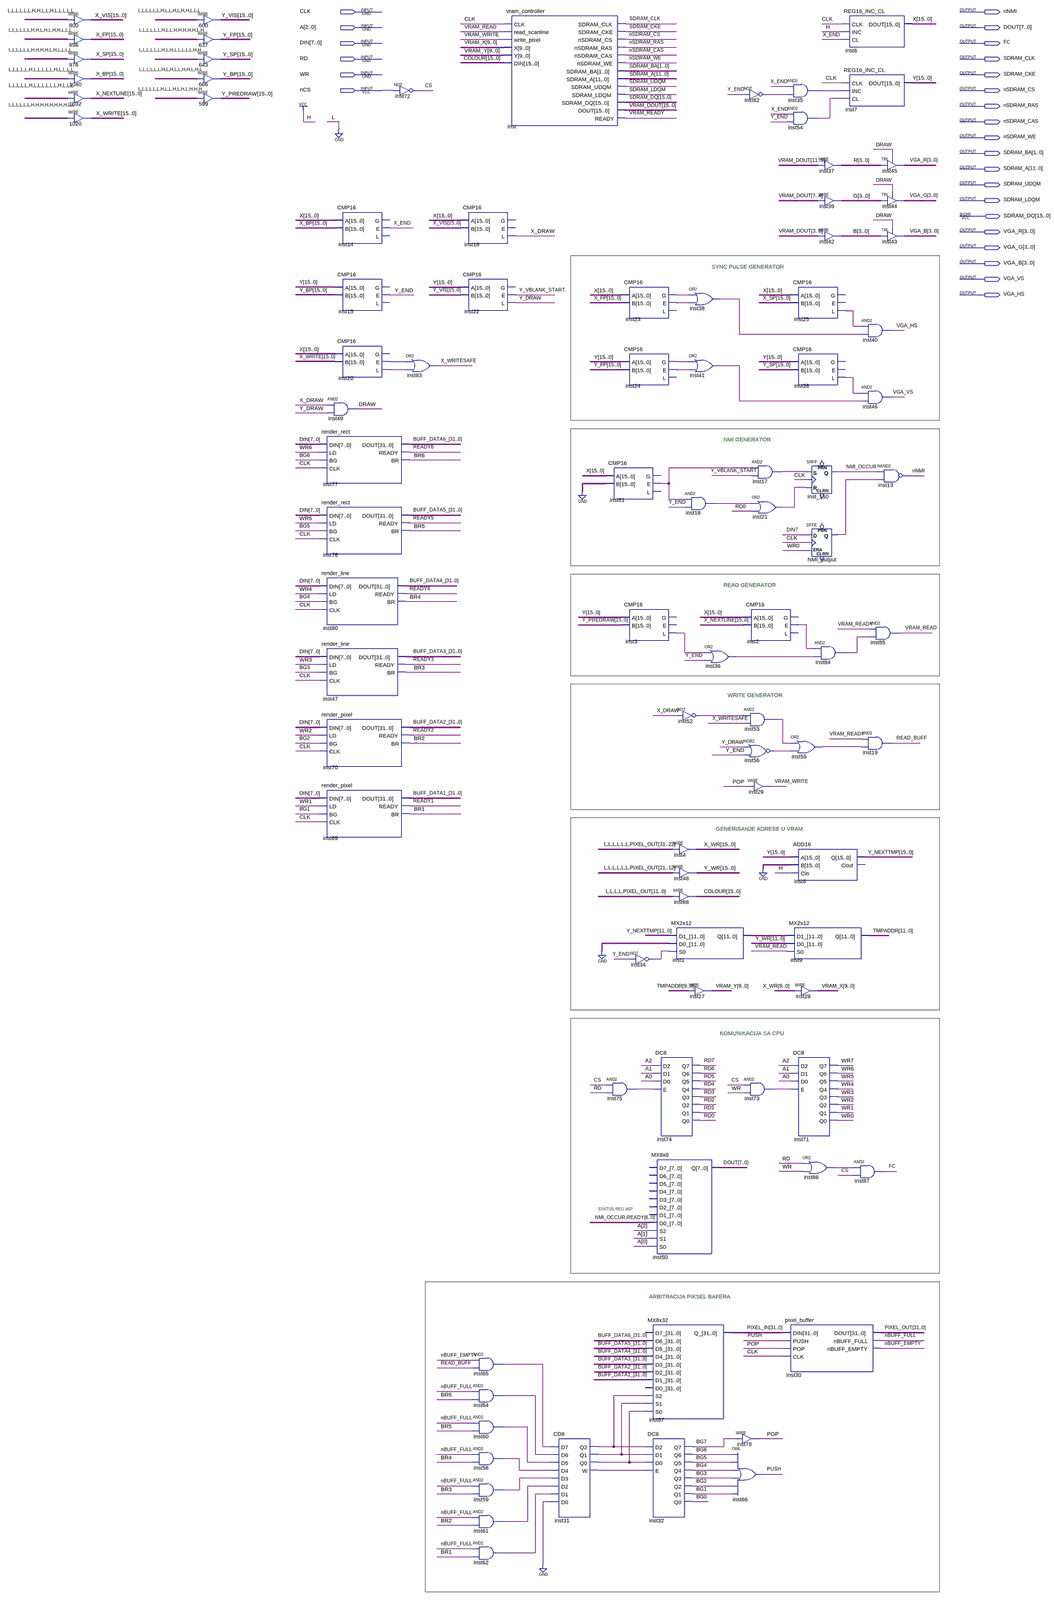
[diagram p0: schematic sheet, whole]
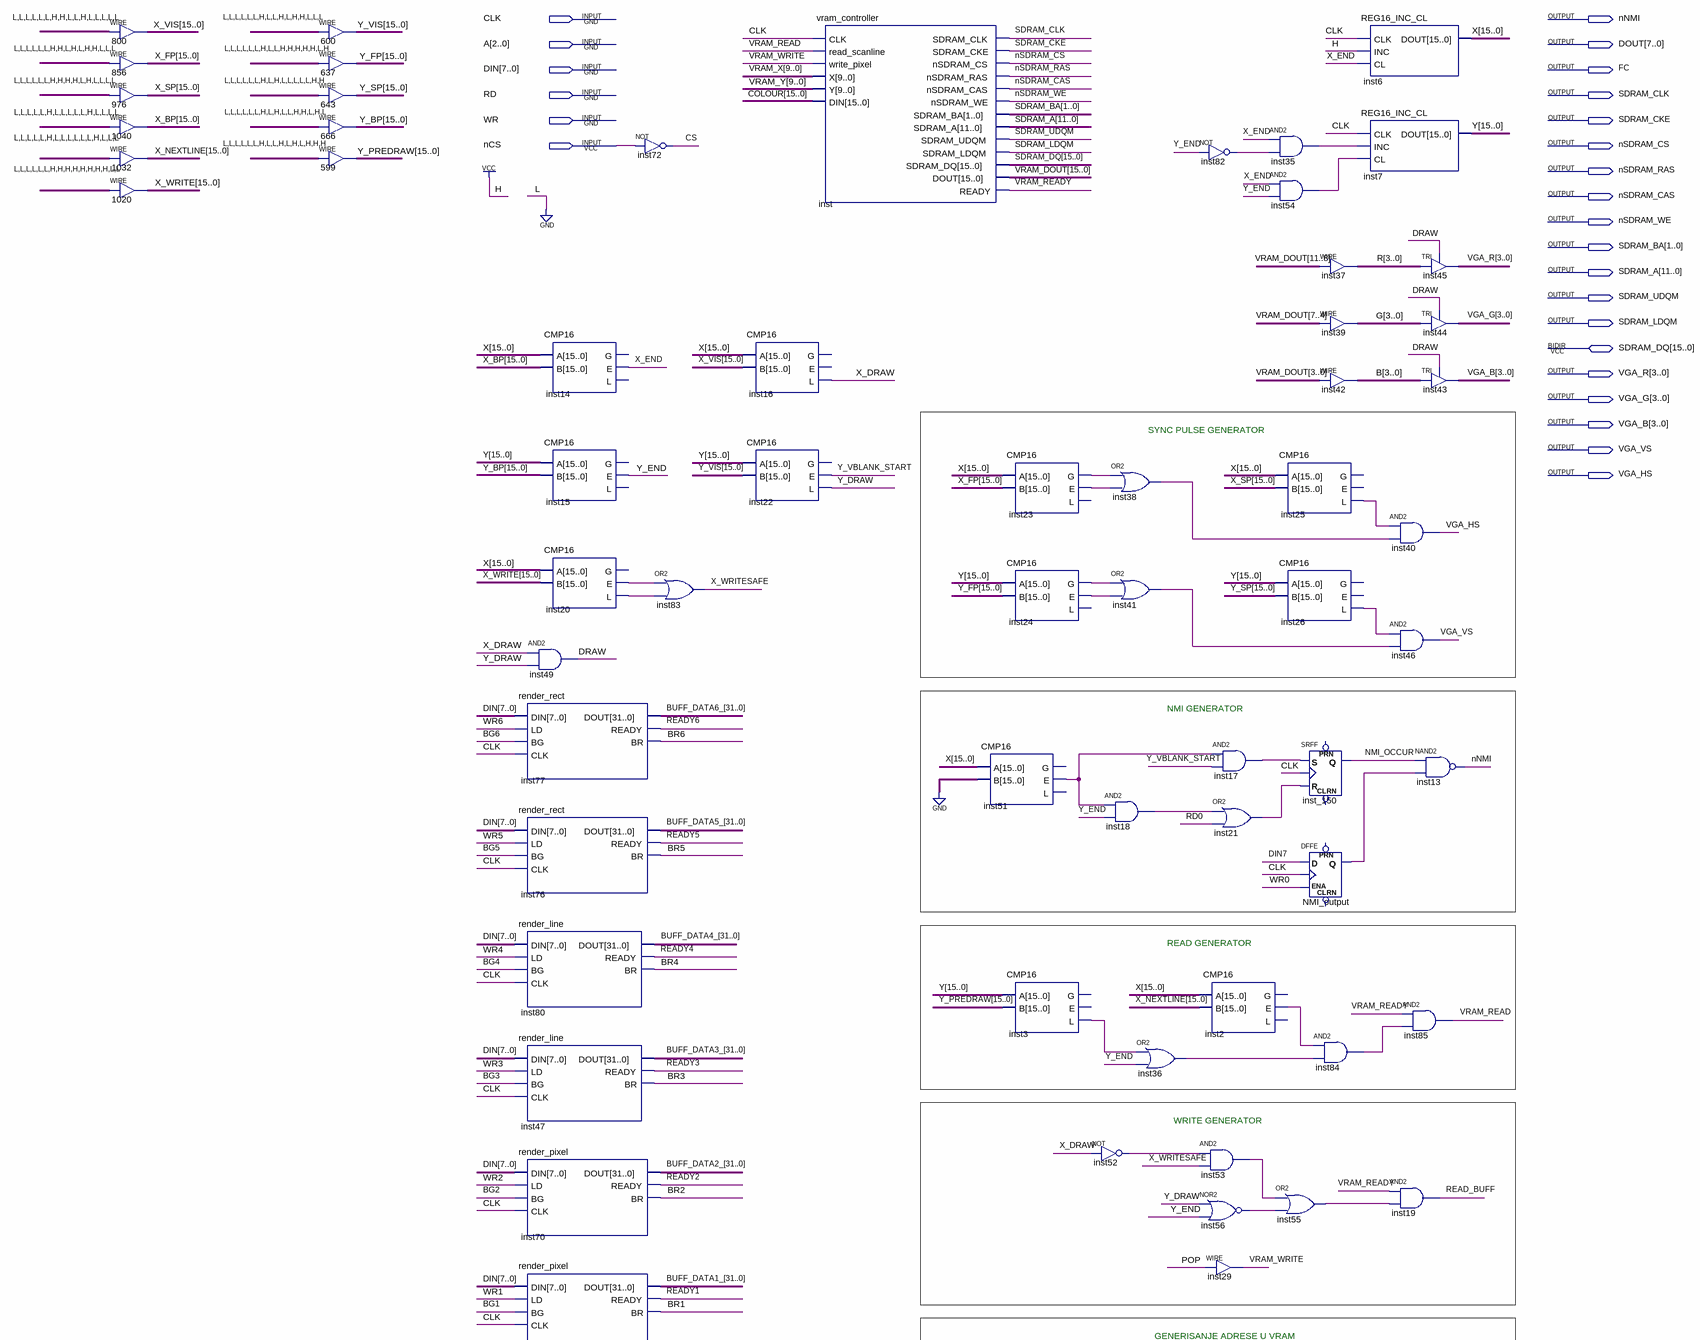
[diagram p1: schematic sheet, upper part]
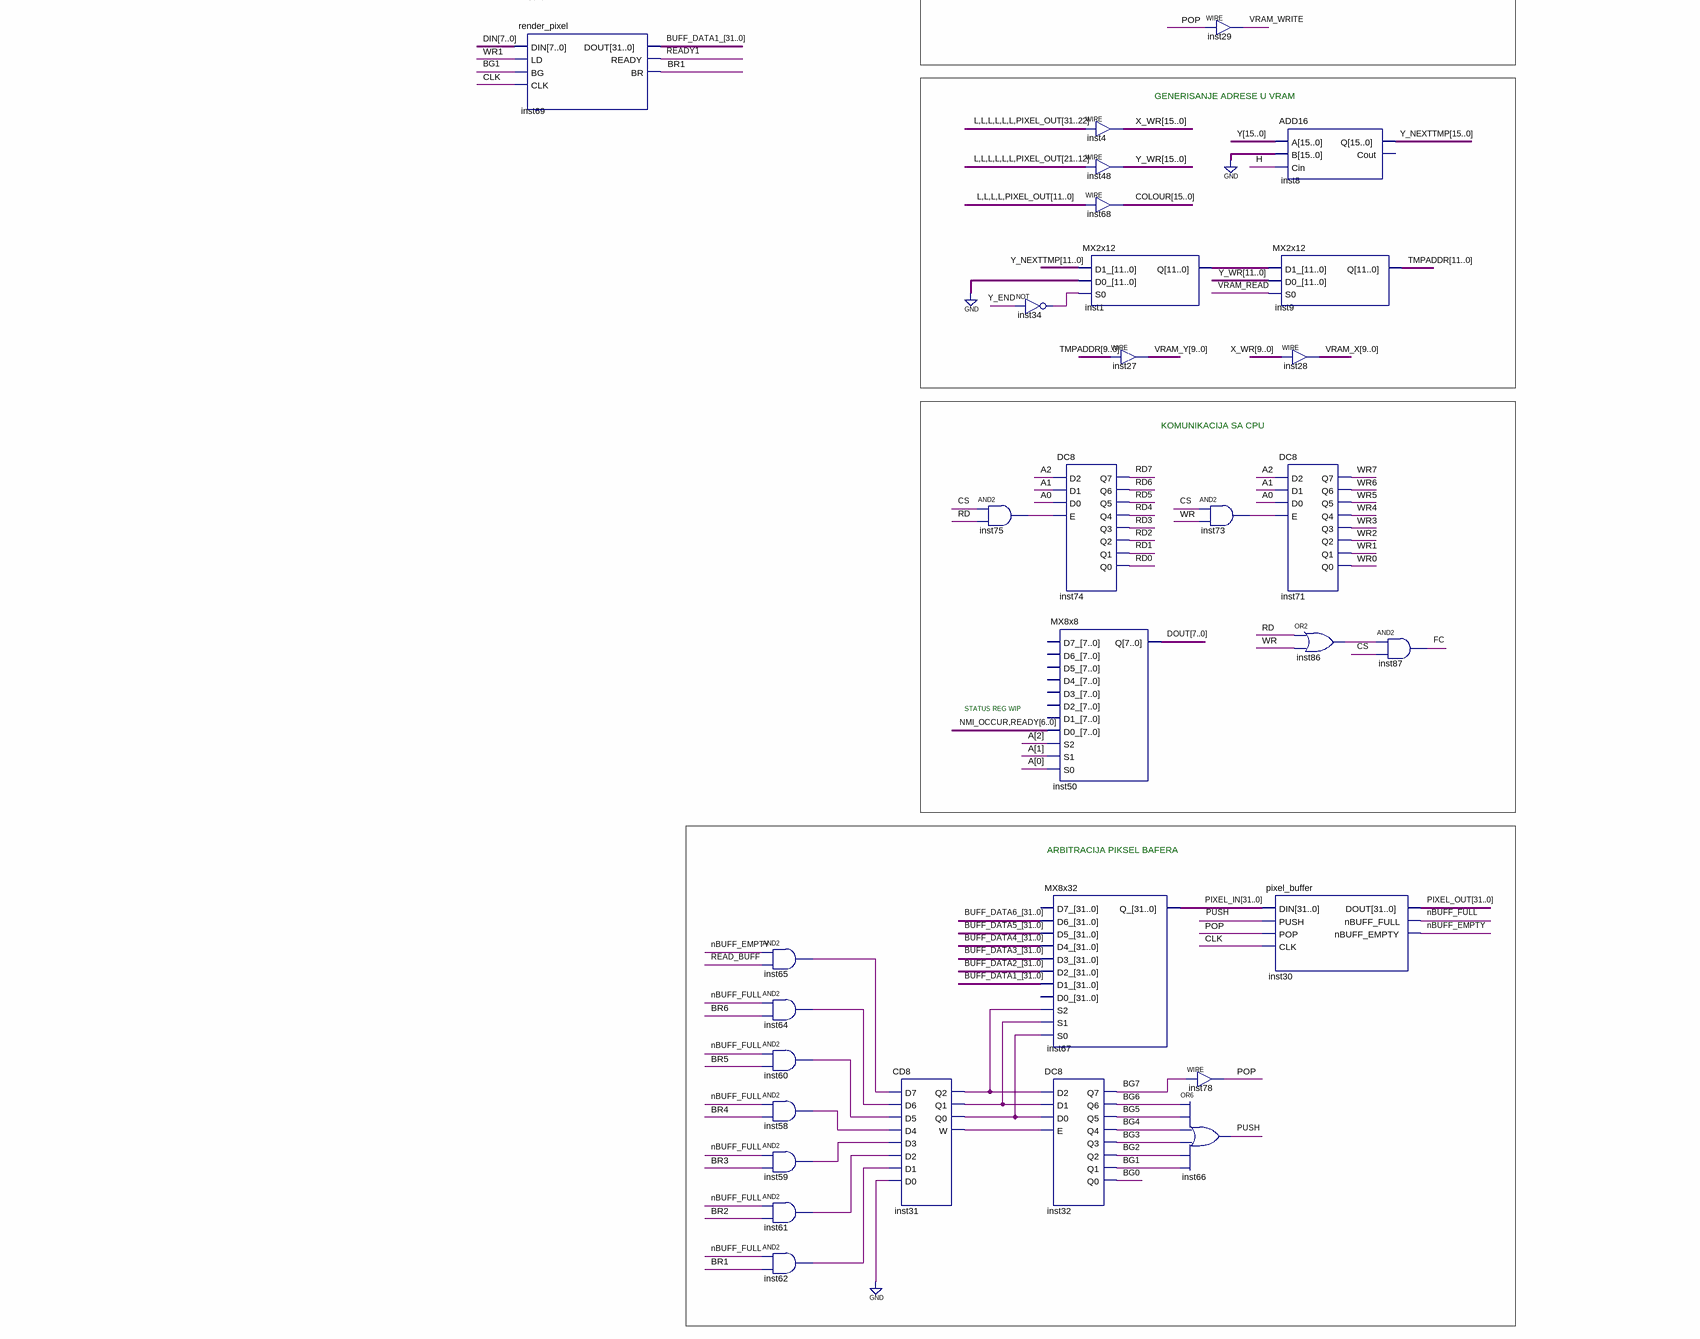
[diagram p2: schematic sheet, lower part]
// Quartus schematic gpu.bdf as structural Verilog: 92 symbols, 25 pins
module gpu (
  input  CLK,
  input  [2:0] A,
  input  [7:0] DIN,
  input  RD,
  input  WR,
  input  nCS,
  inout  [15:0] SDRAM_DQ,
  output nNMI,
  output [7:0] DOUT,
  output FC,
  output SDRAM_CLK,
  output SDRAM_CKE,
  output nSDRAM_CS,
  output nSDRAM_RAS,
  output nSDRAM_CAS,
  output nSDRAM_WE,
  output [1:0] SDRAM_BA,
  output [11:0] SDRAM_A,
  output SDRAM_UDQM,
  output SDRAM_LDQM,
  output [3:0] VGA_R,
  output [3:0] VGA_G,
  output [3:0] VGA_B,
  output VGA_VS,
  output VGA_HS
);

  wire BG0, BG1, BG2, BG3, BG4, BG5, BG6, BG7, BR1, BR2, BR3, BR4, BR5, BR6, CS, DRAW, inst2_e, inst3_l,
       inst17_out, inst18_out, inst20_e, inst20_l, inst21_out, inst23_e, inst23_g, inst24_e, inst24_g,
       inst25_l, inst26_l, inst31_q0, inst31_q1, inst31_q2, inst31_w, inst34_out, inst35_out, inst36_out,
       inst38_out, inst41_out, inst51_e, inst52_out, inst53_out, inst54_out, inst55_out, inst56_out,
       inst58_out, inst59_out, inst60_out, inst61_out, inst62_out, inst64_out, inst65_out, inst73_out,
       inst75_out, inst82_out, inst84_out, inst86_out, nBUFF_EMPTY, nBUFF_FULL, NMI_OCCUR, NMI_output_q, POP,
       PUSH, RD0, RD1, RD2, RD3, RD4, RD5, RD6, RD7, READ_BUFF, VRAM_READ, VRAM_READY, VRAM_WRITE, WR0, WR1,
       WR2, WR3, WR4, WR5, WR6, WR7, X_DRAW, X_END, X_WRITESAFE, Y_DRAW, Y_END, Y_VBLANK_START;
  wire [3:0] B, G, R;
  wire [6:0] READY;
  wire [9:0] VRAM_X, VRAM_Y;
  wire [11:0] inst1_q, TMPADDR;
  wire [15:0] COLOUR, VRAM_DOUT, X, X_BP, X_FP, X_NEXTLINE, X_SP, X_VIS, X_WR, X_WRITE, Y, Y_BP, Y_FP,
       Y_NEXTTMP, Y_PREDRAW, Y_SP, Y_VIS, Y_WR;
  wire [31:0] BUFF_DATA1_, BUFF_DATA2_, BUFF_DATA3_, BUFF_DATA4_, BUFF_DATA5_, BUFF_DATA6_, PIXEL_IN,
       PIXEL_OUT;

  assign X_VIS = 16'b0000001100100000;  // WIRE 800
  assign X_FP = 16'b0000001101011000;  // WIRE 856
  assign X_SP = 16'b0000001111010000;  // WIRE 976
  assign X_BP = 16'b0000010000010000;  // WIRE 1040
  assign X_NEXTLINE = 16'b0000010000001000;  // WIRE 1032
  assign X_WRITE = 16'b0000001111111100;  // WIRE 1020
  assign Y_VIS = 16'b0000001001011000;  // WIRE 600
  assign Y_FP = 16'b0000001001111101;  // WIRE 637
  assign Y_SP = 16'b0000001010000011;  // WIRE 643
  assign Y_BP = 16'b0000001010011010;  // WIRE 666
  assign Y_PREDRAW = 16'b0000001001010111;  // WIRE 599
  CMP16 inst14 (.A(X), .B(X_BP), .E(X_END));  // open: G, L
  CMP16 inst15 (.A(Y), .B(Y_BP), .E(Y_END));  // open: G, L
  CMP16 inst20 (.A(X), .B(X_WRITE), .E(inst20_e), .L(inst20_l));  // open: G
  and inst49 (DRAW, X_DRAW, Y_DRAW);
  render_rect inst77 (.DIN(DIN), .LD(WR6), .BG(BG6), .CLK(CLK), .DOUT(BUFF_DATA6_), .READY(READY[6]), .BR(BR6));
  render_rect inst76 (.DIN(DIN), .LD(WR5), .BG(BG5), .CLK(CLK), .DOUT(BUFF_DATA5_), .READY(READY[5]), .BR(BR5));
  render_line inst80 (.DIN(DIN), .LD(WR4), .BG(BG4), .CLK(CLK), .DOUT(BUFF_DATA4_), .READY(READY[4]), .BR(BR4));
  render_line inst47 (.DIN(DIN), .LD(WR3), .BG(BG3), .CLK(CLK), .DOUT(BUFF_DATA3_), .READY(READY[3]), .BR(BR3));
  render_pixel inst70 (.DIN(DIN), .LD(WR2), .BG(BG2), .CLK(CLK), .DOUT(BUFF_DATA2_), .READY(READY[2]), .BR(BR2));
  render_pixel inst69 (.DIN(DIN), .LD(WR1), .BG(BG1), .CLK(CLK), .DOUT(BUFF_DATA1_), .READY(READY[1]), .BR(BR1));
  not inst72 (CS, nCS);
  or inst83 (X_WRITESAFE, inst20_e, inst20_l);
  CMP16 inst16 (.A(X), .B(X_VIS), .L(X_DRAW));  // open: G, E
  CMP16 inst22 (.A(Y), .B(Y_VIS), .E(Y_VBLANK_START), .L(Y_DRAW));  // open: G
  and inst65 (inst65_out, nBUFF_EMPTY, READ_BUFF);
  and inst64 (inst64_out, nBUFF_FULL, BR6);
  and inst60 (inst60_out, nBUFF_FULL, BR5);
  and inst58 (inst58_out, nBUFF_FULL, BR4);
  and inst59 (inst59_out, nBUFF_FULL, BR3);
  and inst61 (inst61_out, nBUFF_FULL, BR2);
  and inst62 (inst62_out, nBUFF_FULL, BR1);
  vram_controller inst (
    .CLK(CLK), .read_scanline(VRAM_READ), .write_pixel(VRAM_WRITE), .X(VRAM_X), .Y(VRAM_Y), .DIN(COLOUR),
    .SDRAM_CLK(SDRAM_CLK), .SDRAM_CKE(SDRAM_CKE), .nSDRAM_CS(nSDRAM_CS), .nSDRAM_RAS(nSDRAM_RAS),
    .nSDRAM_CAS(nSDRAM_CAS), .nSDRAM_WE(nSDRAM_WE), .SDRAM_BA(SDRAM_BA), .SDRAM_A(SDRAM_A),
    .SDRAM_UDQM(SDRAM_UDQM), .SDRAM_LDQM(SDRAM_LDQM), .DOUT(VRAM_DOUT), .READY(VRAM_READY),
    .SDRAM_DQ(SDRAM_DQ));
  CD8 inst31 (
    .D7(inst65_out), .D6(inst64_out), .D5(inst60_out), .D4(inst58_out), .D3(inst59_out), .D2(inst61_out),
    .D1(inst62_out), .D0(1'b0), .Q2(inst31_q2), .Q1(inst31_q1), .Q0(inst31_q0), .W(inst31_w));
  CMP16 inst23 (.A(X), .B(X_FP), .G(inst23_g), .E(inst23_e));  // open: L
  CMP16 inst24 (.A(Y), .B(Y_FP), .G(inst24_g), .E(inst24_e));  // open: L
  CMP16 inst51 (.A(X), .B({16{1'b0}}), .E(inst51_e));  // open: G, L
  CMP16 inst3 (.A(Y), .B(Y_PREDRAW), .L(inst3_l));  // open: G, E
  not inst34 (inst34_out, Y_END);
  and inst75 (inst75_out, CS, RD);
  DC8 inst74 (
    .D2(A[2]), .D1(A[1]), .D0(A[0]), .E(inst75_out), .Q7(RD7), .Q6(RD6), .Q5(RD5), .Q4(RD4), .Q3(RD3),
    .Q2(RD2), .Q1(RD1), .Q0(RD0));
  MX8x8 inst50 (
    .D0_({NMI_OCCUR, READY}), .S2(A[2]), .S1(A[1]), .S0(A[0]), .Q(DOUT));  // open: D7_, D6_, D5_, D4_, D3_, D2_, D1_
  MX8x32 inst67 (
    .D6_(BUFF_DATA6_), .D5_(BUFF_DATA5_), .D4_(BUFF_DATA4_), .D3_(BUFF_DATA3_), .D2_(BUFF_DATA2_),
    .D1_(BUFF_DATA1_), .S2(inst31_q2), .S1(inst31_q1), .S0(inst31_q0), .Q_(PIXEL_IN));  // open: D7_, D0_
  DC8 inst32 (
    .D2(inst31_q2), .D1(inst31_q1), .D0(inst31_q0), .E(inst31_w), .Q7(BG7), .Q6(BG6), .Q5(BG5), .Q4(BG4),
    .Q3(BG3), .Q2(BG2), .Q1(BG1), .Q0(BG0));
  or inst38 (inst38_out, inst23_g, inst23_e);
  or inst41 (inst41_out, inst24_g, inst24_e);
  and inst18 (inst18_out, inst51_e, Y_END);
  not inst52 (inst52_out, X_DRAW);
  assign X_WR = {{6{1'b0}}, PIXEL_OUT[31:22]};  // WIRE inst4
  assign Y_WR = {{6{1'b0}}, PIXEL_OUT[21:12]};  // WIRE inst48
  assign COLOUR = {4'b0000, PIXEL_OUT[11:0]};  // WIRE inst68
  MX2x12 inst1 (.D1_(Y_NEXTTMP[11:0]), .D0_({12{1'b0}}), .S0(inst34_out), .Q(inst1_q));
  assign VRAM_Y = TMPADDR[9:0];  // WIRE inst27
  or inst36 (inst36_out, inst3_l, Y_END);
  not inst82 (inst82_out, Y_END);
  and inst17 (inst17_out, inst51_e, Y_VBLANK_START);
  or inst21 (inst21_out, inst18_out, RD0);
  CMP16 inst2 (.A(X), .B(X_NEXTLINE), .E(inst2_e));  // open: G, L
  and inst53 (inst53_out, inst52_out, X_WRITESAFE);
  nor inst56 (inst56_out, Y_DRAW, Y_END);
  assign VRAM_WRITE = POP;  // WIRE inst29
  and inst73 (inst73_out, CS, WR);
  assign POP = BG7;  // WIRE inst78
  or inst66 (PUSH, BG6, BG5, BG4, BG3, BG2, BG1);
  and inst35 (inst35_out, X_END, inst82_out);
  and inst54 (inst54_out, X_END, Y_END);
  MX2x12 inst9 (.D1_(inst1_q), .D0_(Y_WR[11:0]), .S0(VRAM_READ), .Q(TMPADDR));
  pixel_buffer inst30 (
    .DIN(PIXEL_IN), .PUSH(PUSH), .POP(POP), .CLK(CLK), .DOUT(PIXEL_OUT), .nBUFF_FULL(nBUFF_FULL),
    .nBUFF_EMPTY(nBUFF_EMPTY));
  assign R = VRAM_DOUT[11:8];  // WIRE inst37
  assign G = VRAM_DOUT[7:4];  // WIRE inst39
  assign B = VRAM_DOUT[3:0];  // WIRE inst42
  CMP16 inst25 (.A(X), .B(X_SP), .L(inst25_l));  // open: G, E
  CMP16 inst26 (.A(Y), .B(Y_SP), .L(inst26_l));  // open: G, E
  SRFF inst_150 (.S(inst17_out), .R(inst21_out), .CLK(CLK), .Q(NMI_OCCUR));  // open: PRN, CLRN
  DFFE NMI_output (.D(DIN[7]), .CLK(CLK), .ENA(WR0), .Q(NMI_output_q));  // open: PRN, CLRN
  and inst84 (inst84_out, inst2_e, inst36_out);
  or inst55 (inst55_out, inst53_out, inst56_out);
  ADD16 inst8 (.A(Y), .B({16{1'b0}}), .Cin(1'b1), .Q(Y_NEXTTMP));  // open: Cout
  assign VRAM_X = X_WR[9:0];  // WIRE inst28
  DC8 inst71 (
    .D2(A[2]), .D1(A[1]), .D0(A[0]), .E(inst73_out), .Q7(WR7), .Q6(WR6), .Q5(WR5), .Q4(WR4), .Q3(WR3),
    .Q2(WR2), .Q1(WR1), .Q0(WR0));
  or inst86 (inst86_out, RD, WR);
  REG16_INC_CL inst6 (.CLK(CLK), .INC(1'b1), .CL(X_END), .DOUT(X));
  REG16_INC_CL inst7 (.CLK(CLK), .INC(inst35_out), .CL(inst54_out), .DOUT(Y));
  TRI inst45[3:0] (.IN(R), .OE(DRAW), .OUT(VGA_R));
  TRI inst44[3:0] (.IN(G), .OE(DRAW), .OUT(VGA_G));
  TRI inst43[3:0] (.IN(B), .OE(DRAW), .OUT(VGA_B));
  and inst40 (VGA_HS, inst25_l, inst38_out);
  and inst46 (VGA_VS, inst26_l, inst41_out);
  nand inst13 (nNMI, NMI_OCCUR, NMI_output_q);
  and inst85 (VRAM_READ, VRAM_READY, inst84_out);
  and inst19 (READ_BUFF, VRAM_READY, inst55_out);
  and inst87 (FC, inst86_out, CS);

  // Notes on the sheet:
  //   SYNC PULSE GENERATOR
  //   NMI GENERATOR
  //   READ GENERATOR
  //   WRITE GENERATOR
  //   GENERISANJE ADRESE U VRAM
  //   KOMUNIKACIJA SA CPU
  //   STATUS REG WIP
  //   ARBITRACIJA PIKSEL BAFERA
endmodule
